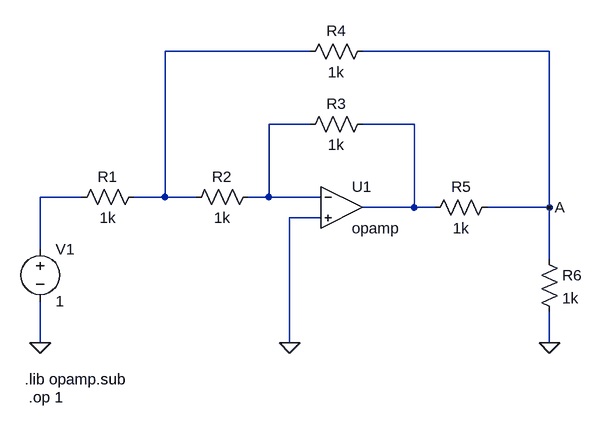
[diagram p0: schematic Draft4.asc]
Draft4.asc, the LTspice schematic file:
Version 4
SHEET 1 880 680
WIRE 272 -480 48 -480
WIRE 640 -480 352 -480
WIRE 272 -368 208 -368
WIRE 432 -368 352 -368
WIRE -80 -256 -144 -256
WIRE 48 -256 48 -480
WIRE 48 -256 0 -256
WIRE 96 -256 48 -256
WIRE 208 -256 208 -368
WIRE 208 -256 176 -256
WIRE 288 -256 208 -256
WIRE 432 -240 432 -368
WIRE 432 -240 352 -240
WIRE 464 -240 432 -240
WIRE 640 -240 640 -480
WIRE 640 -240 544 -240
WIRE 288 -224 240 -224
WIRE -144 -176 -144 -256
WIRE 640 -160 640 -240
WIRE -144 -32 -144 -96
WIRE 240 -32 240 -224
WIRE 640 -32 640 -80
FLAG 240 -32 0
FLAG -144 -32 0
FLAG 640 -32 0
FLAG 640 -240 A
SYMBOL Opamps\\opamp 320 -304 R0
SYMATTR InstName U1
SYMATTR SpiceLine Aol=10000000000000t
SYMATTR SpiceLine2 GBW=10t
SYMBOL res 16 -272 R90
WINDOW 0 0 56 VBottom 2
WINDOW 3 32 56 VTop 2
SYMATTR InstName R1
SYMATTR Value 1k
SYMATTR SpiceLine tol=0
SYMBOL res 192 -272 R90
WINDOW 0 0 56 VBottom 2
WINDOW 3 32 56 VTop 2
SYMATTR InstName R2
SYMATTR Value 1k
SYMATTR SpiceLine tol=0
SYMBOL res 368 -384 R90
WINDOW 0 0 56 VBottom 2
WINDOW 3 32 56 VTop 2
SYMATTR InstName R3
SYMATTR Value 1k
SYMATTR SpiceLine tol=0
SYMBOL res 368 -496 R90
WINDOW 0 0 56 VBottom 2
WINDOW 3 32 56 VTop 2
SYMATTR InstName R4
SYMATTR Value 1k
SYMATTR SpiceLine tol=0
SYMBOL res 560 -256 R90
WINDOW 0 0 56 VBottom 2
WINDOW 3 32 56 VTop 2
SYMATTR InstName R5
SYMATTR Value 1k
SYMATTR SpiceLine tol=0
SYMBOL res 624 -176 R0
SYMATTR InstName R6
SYMATTR Value 1k
SYMATTR SpiceLine tol=0
SYMBOL voltage -144 -192 R0
WINDOW 123 0 0 Left 0
WINDOW 39 0 0 Left 0
SYMATTR InstName V1
SYMATTR Value 1
TEXT -168 24 Left 2 !.lib opamp.sub
TEXT -162 52 Left 2 !.op 1

The netlist it stands for:
* Draft4.asc
XU1 N002 0 N003 opamp Aol=10000000000000t GBW=10t  ; pins invin noninvin out
R1 N001 N004 1k tol=0
R2 N002 N001 1k tol=0
R3 N003 N002 1k tol=0
R4 A N001 1k tol=0
R5 A N003 1k tol=0
R6 A 0 1k tol=0
V1 N004 0 1
.lib opamp.sub
.op 1
.backanno
.end